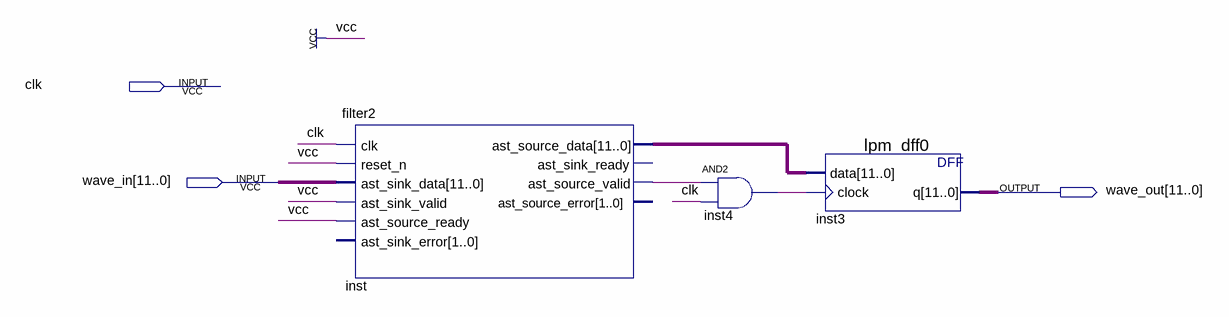
[diagram p0: schematic sheet]
// Quartus schematic filter.bdf as structural Verilog: 3 symbols, 3 pins
module filter (
  input  clk,
  input  [11:0] wave_in,
  output [11:0] wave_out
);

  wire inst4_out, inst_ast_source_valid;
  wire [11:0] inst_ast_source_data;

  filter2 inst (
    .clk(clk), .reset_n(1'b1), .ast_sink_data(wave_in), .ast_sink_valid(1'b1), .ast_source_ready(1'b1),
    .ast_source_data(inst_ast_source_data), .ast_source_valid(inst_ast_source_valid));  // open: ast_sink_error, ast_sink_ready, ast_source_error
  and inst4 (inst4_out, inst_ast_source_valid, clk);
  lpm_dff0 inst3 (.data(inst_ast_source_data), .clock(inst4_out), .q(wave_out));
endmodule
